# EAGLE design motherboardV2 (EAGLE 7.2.0)
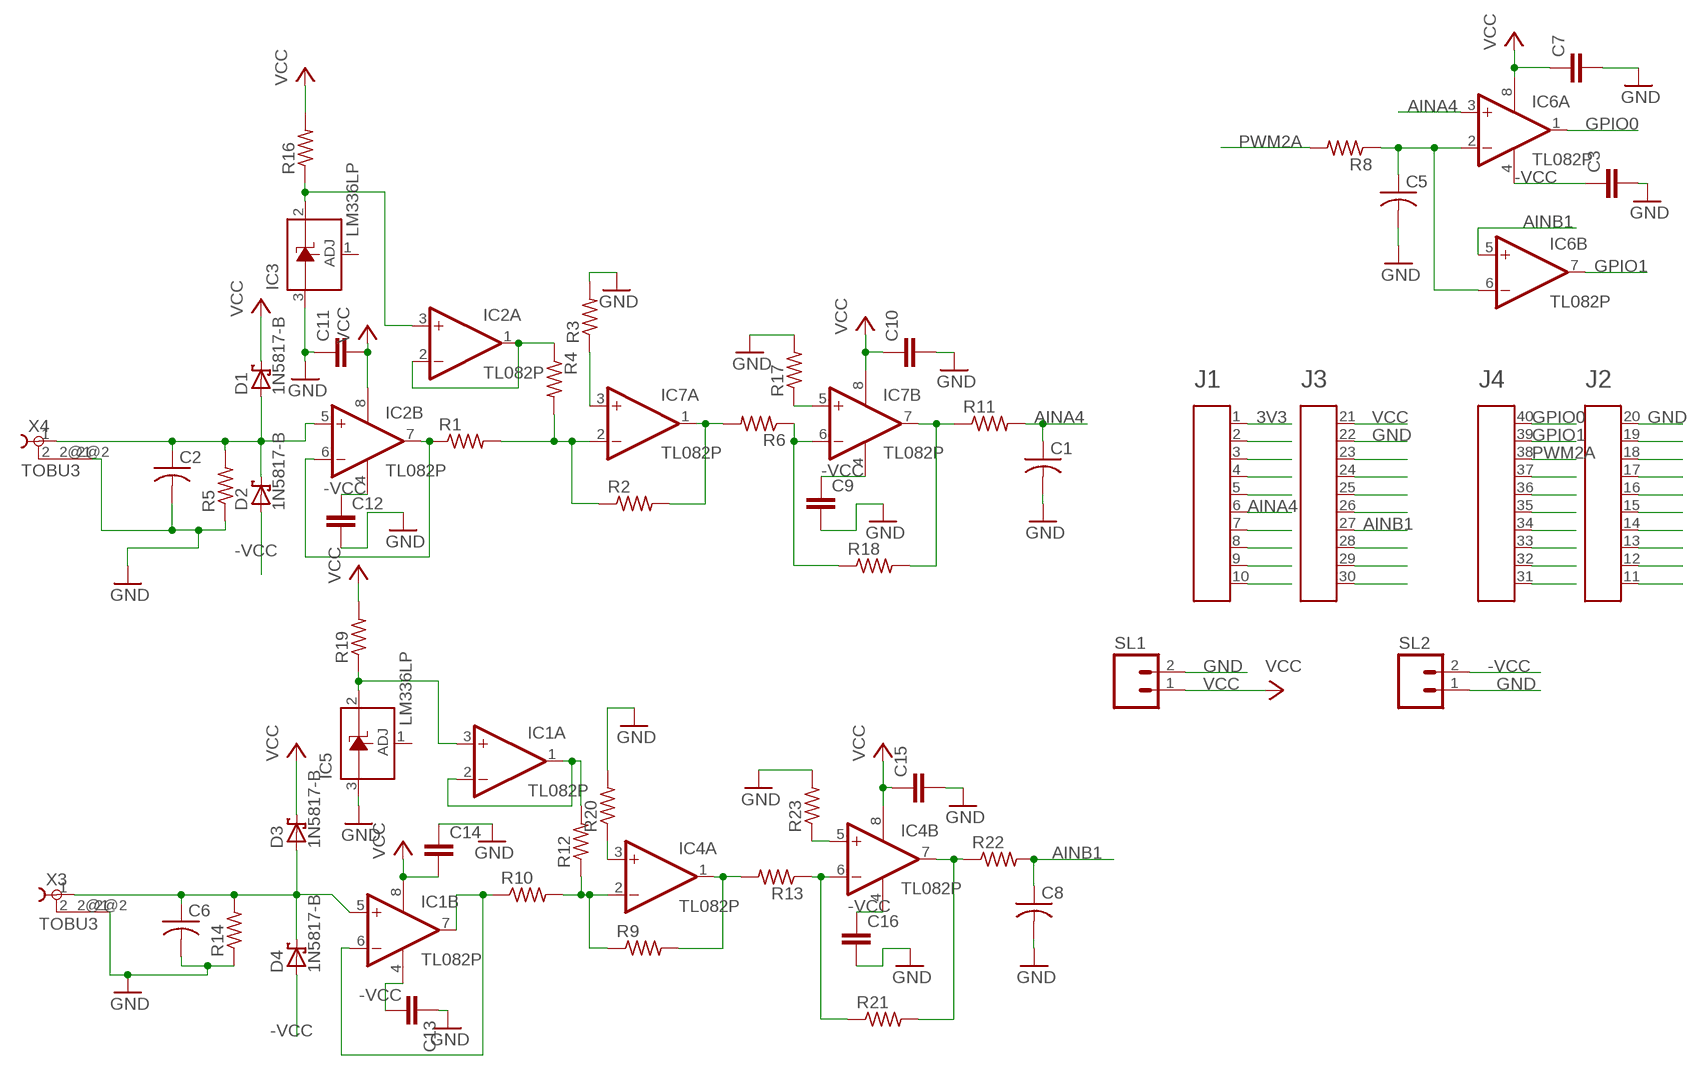
[diagram p0: schematic, sheet 1]

## Parts
A1  HEADER4X10-BOOSTERPACK  [4X10-BOOSTERPACK]
C1  C-US025-025X050  [C025-025X050]
C2  C-US025-025X050  [C025-025X050]
C3  C-EU025-025X050  [C025-025X050]
C5  C-US025-025X050  [C025-025X050]
C6  C-US025-025X050  [C025-025X050]
C7  C-EU025-025X050  [C025-025X050]
C8  C-US025-025X050  [C025-025X050]
C9  C-EU025-025X050  [C025-025X050]
C10  C-EU025-025X050  [C025-025X050]
C11  C-EU025-025X050  [C025-025X050]
C12  C-EU025-030X050  [C025-030X050]
C13  C-EU025-025X050  [C025-025X050]
C14  C-EU025-025X050  [C025-025X050]
C15  C-EU025-025X050  [C025-025X050]
C16  C-EU025-025X050  [C025-025X050]
D1  1N5817-B  [DO41-7.6]
D2  1N5817-B  [DO41-7.6]
D3  1N5817-B  [DO41-7.6]
D4  1N5817-B  [DO41-7.6]
IC1  TL082P  [DIL08]
IC2  TL082P  [DIL08]
IC3  LM336LP  [TO92]
IC4  TL082P  [DIL08]
IC5  LM336LP  [TO92]
IC6  TL082P  [DIL08]
IC7  TL082P  [DIL08]
R1  R-US_0207/7  [0207/7]
R2  R-US_0207/7  [0207/7]
R3  R-US_0207/7  [0207/7]
R4  R-US_0207/7  [0207/7]
R5  R-US_0207/7  [0207/7]
R6  R-US_0207/7  [0207/7]
R8  R-US_0207/7  [0207/7]
R9  R-US_0207/7  [0207/7]
R10  R-US_0207/7  [0207/7]
R11  R-US_0207/7  [0207/7]
R12  R-US_0207/7  [0207/7]
R13  R-US_0207/7  [0207/7]
R14  R-US_0207/7  [0207/7]
R16  R-US_0207/7  [0207/7]
R17  R-US_0207/7  [0207/7]
R18  R-US_0207/7  [0207/7]
R19  R-US_0207/7  [0207/7]
R20  R-US_0207/7  [0207/7]
R21  R-US_0207/7  [0207/7]
R22  R-US_0207/7  [0207/7]
R23  R-US_0207/7  [0207/7]
SL1  M02  [02P]
SL2  M02  [02P]
X3  TOBU3  [TOBU3]
X4  TOBU3  [TOBU3]

## Nets
3V3: A1.1
-VCC: C3.1 C9.1 C12.1 C13.2 C16.1 D2.A D4.A IC1.4(P:V-) IC2.4(P:V-) IC4.4(P:V-) IC6.4(P:V-) IC7.4(P:V-) SL2.2
AINA4: A1.6 C1.1 IC6.3(A:+IN) R11.2
AINB1: A1.27 C8.1 IC6.5(B:+IN) R22.2
GND: A1.20 A1.22 C1.2 C2.2 C3.2 C5.2 C6.2 C7.2 C8.2 C9.2 C10.2 C11.1 C12.2 C13.1 C14.1 C15.2 C16.2 IC3.3(A) IC5.3(A) R3.2 R5.1 R14.1 R17.2 R20.2 R23.2 SL1.2 SL2.1 X3.2@2 X4.2@2
GPIO0: A1.40 IC6.1(A:OUT)
GPIO1: A1.39 IC6.7(B:OUT)
N$1: A1.12
N$2: IC2.3(A:+IN) IC3.2(C) R16.1
N$3: IC7.2(A:-IN) R1.2 R2.1 R4.2
N$4: C6.1 D3.A D4.C IC1.5(B:+IN) R14.2 X3.1
N$5: IC7.1(A:OUT) R2.2 R6.2
N$6: IC7.3(A:+IN) R3.1
N$7: IC1.3(A:+IN) IC5.2(C) R19.1
N$8: C5.1 IC6.2(A:-IN) IC6.6(B:-IN) R8.1
N$9: A1.11
N$11: IC2.1(A:OUT) IC2.2(A:-IN) R4.1
N$13: IC7.6(B:-IN) R6.1 R18.1
N$14: IC4.2(A:-IN) R9.1 R10.2 R12.1
N$16: IC1.1(A:OUT) IC1.2(A:-IN) R12.2
N$17: IC7.5(B:+IN) R17.1
N$19: C2.1 D1.A D2.C IC2.5(B:+IN) R5.2 X4.1
N$20: IC4.1(A:OUT) R9.2 R13.2
N$21: IC7.7(B:OUT) R11.1 R18.2
N$22: IC4.3(A:+IN) R20.1
N$23: IC4.7(B:OUT) R21.2 R22.1
N$24: IC4.6(B:-IN) R13.1 R21.1
N$25: IC4.5(B:+IN) R23.1
N$26: A1.2
N$27: A1.3
N$28: A1.4
N$29: A1.5
N$31: A1.7
N$32: A1.8
N$33: A1.9
N$34: IC1.6(B:-IN) IC1.7(B:OUT) R10.1
N$35: A1.23
N$36: A1.24
N$37: A1.25
N$38: A1.26
N$40: A1.28
N$41: A1.29
N$42: A1.10
N$43: A1.30
N$44: IC2.6(B:-IN) IC2.7(B:OUT) R1.1
N$47: A1.37
N$48: A1.36
N$49: A1.35
N$50: A1.34
N$51: A1.33
N$52: A1.32
N$53: A1.31
N$55: A1.19
N$56: A1.18
N$57: A1.17
N$58: A1.16
N$59: A1.15
N$60: A1.14
N$61: A1.13
PWM2A: A1.38 R8.2
VCC: A1.21 C7.1 C10.1 C11.2 C14.2 C15.1 D1.C D3.C IC1.8(P:V+) IC2.8(P:V+) IC4.8(P:V+) IC6.8(P:V+) IC7.8(P:V+) R16.2 R19.2 SL1.1
Unconnected: IC3.1(ADJ) IC5.1(ADJ) X3.2 X3.2@1 X4.2 X4.2@1

## Library data of the parts
A1 = EAGLE_BoosterPack_Library:HEADER4X10-BOOSTERPACK
C1 C2 C5 C6 C8 = rcl:C-US: CAPACITOR, American symbol
C3 C7 C9-C16 = rcl:C-EU: CAPACITOR, European symbol
D1-D4 = diode:1N581*: 1.0A SCHOTTKY BARRIER RECTIFIER Source: http://www.diodes.com/datasheets/ds23001.pdf
IC1 IC2 IC4 IC6 IC7 = linear:TL082: OP AMP Data sheet <http://www.ti.com/lit/ds/symlink/tl084a . pdf>; DATA_SHEET: <a href="http://www.ti.com/lit/ds/symlink/tl084a.pdf"> Data sheet </a>
IC3 IC5 = linear:LM336: 2.5-V INTEGRATED REFERENCE CIRCUITS LM236 Source: http://focus.ti.com/lit/ds/symlink/lm336-2.5.pdf
R1-R6 R9-R14 R17 R18 = resistor:R-US_: RESISTOR, American symbol
R8 R16 R19-R23 = rcl:R-US_: RESISTOR, American symbol
SL1 SL2 = CEDT_JANUARY_2015_v5:M02: AMP QUICK CONNECTOR
X3 X4 = CEDT_JANUARY_2015_v5:TOBU3: Female Cinch CONNECTOR ( RCA Jack )

## Board
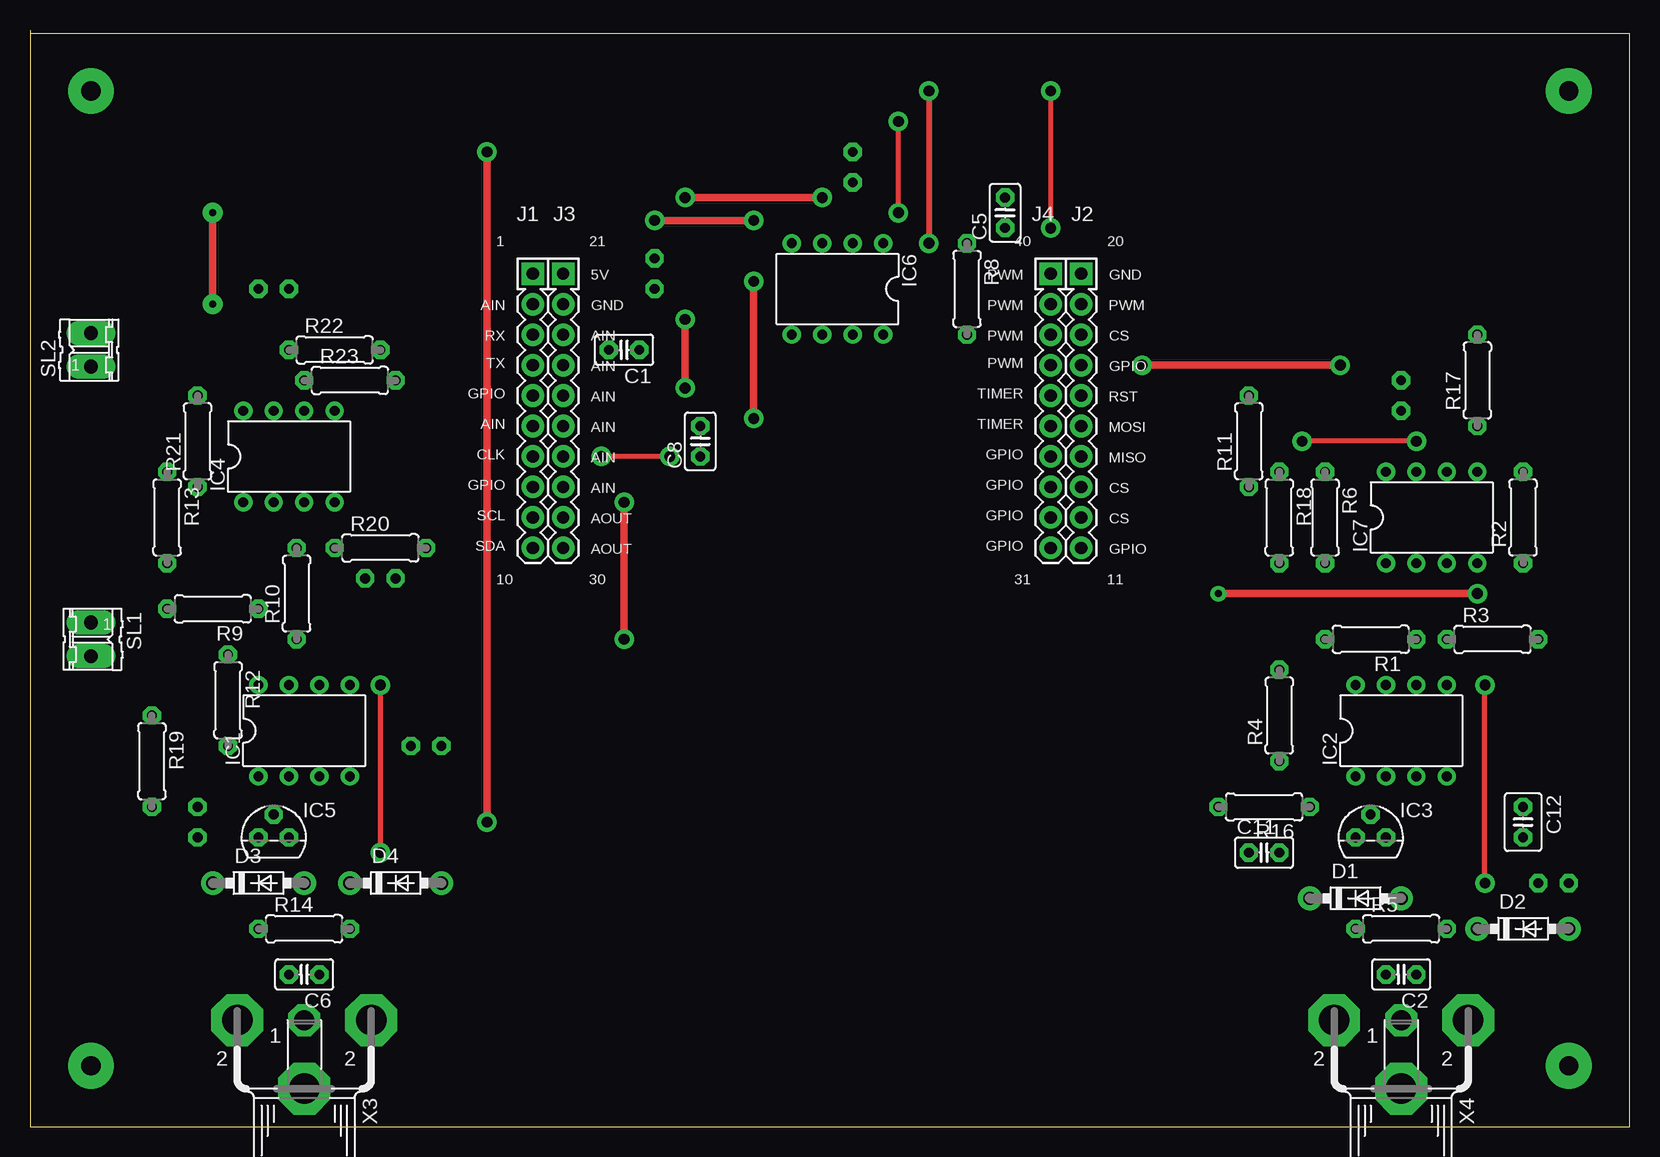
[diagram p1: board, top side]
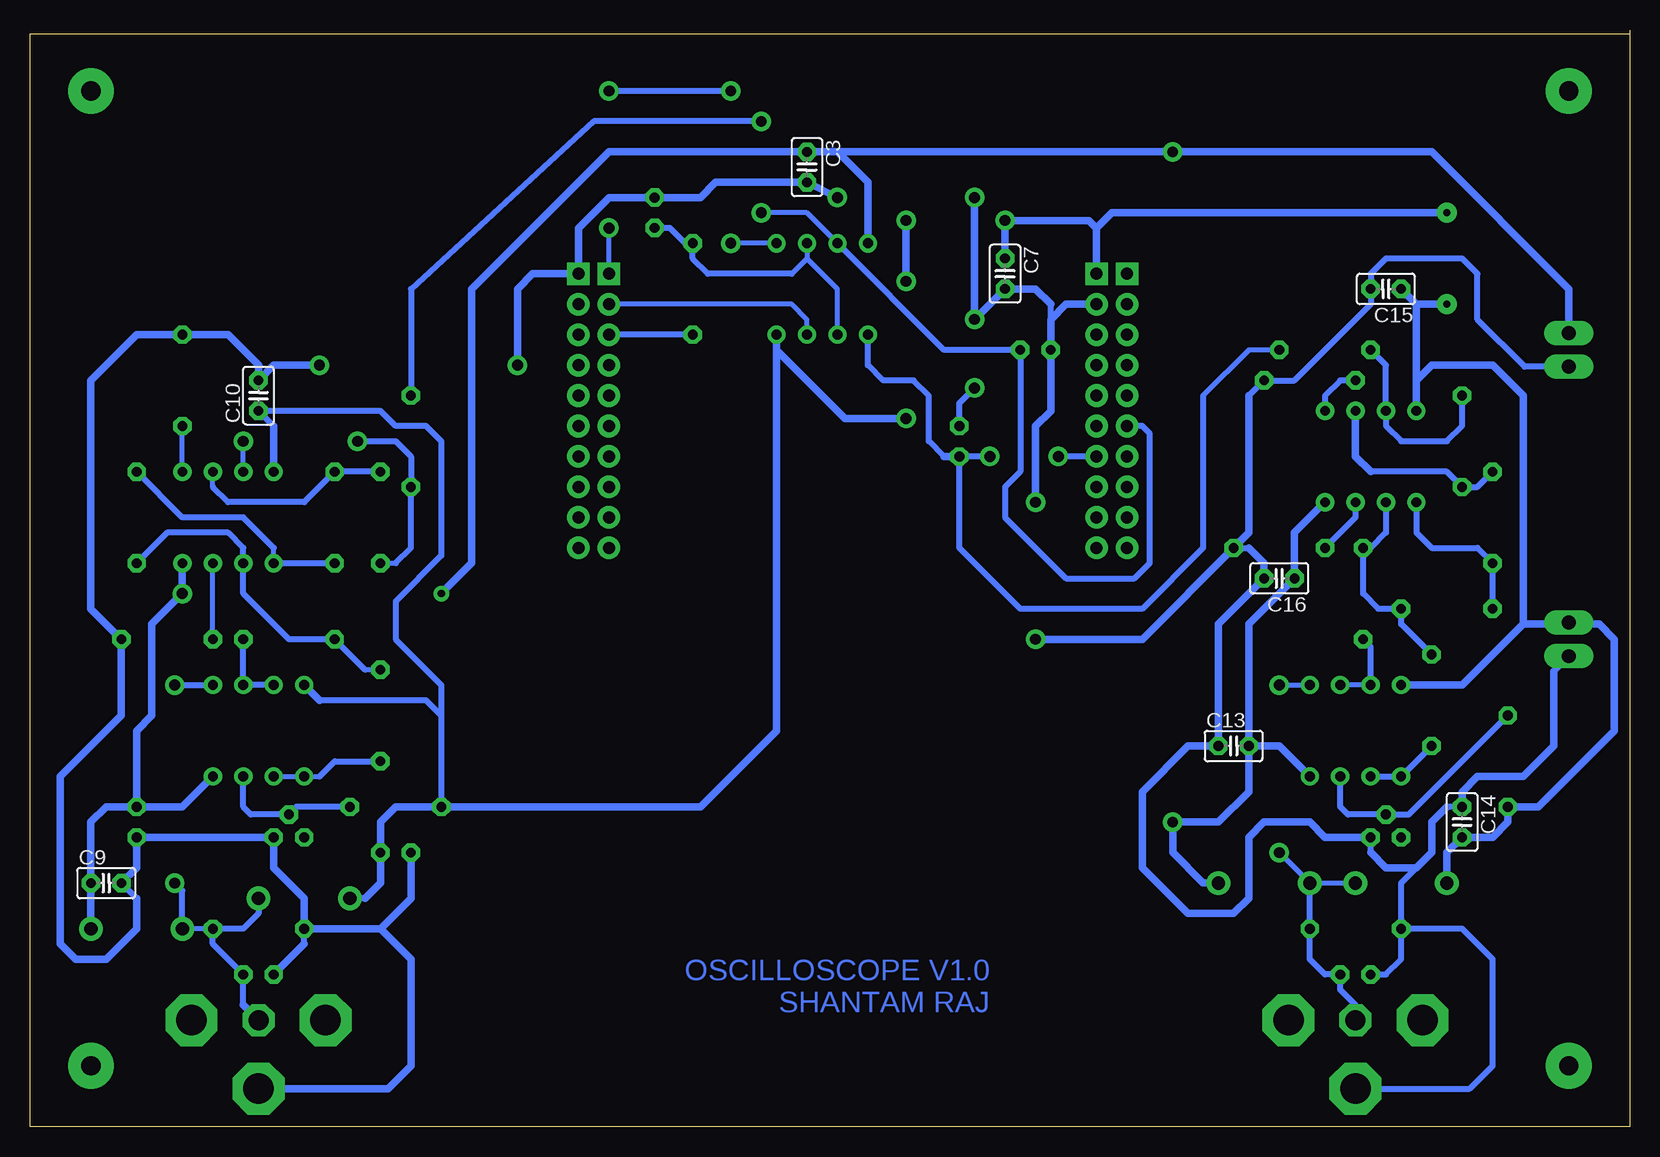
[diagram p2: board, bottom side, seen from below]

Size 133.35 x 91.44 mm. Coordinates in mm from the lower left corner, seen from the top.
Outline: 0.01,91.11 133.35,91.11 133.35,0 0.01,0
Outline: 0,91.44 0,0
Copper layers (1*16): Top 0.035mm / dielectric 1.5mm / Bottom 0.035mm
Design rules "default *": minimum track width 10mil, minimum drill 24mil, track to track 8mil, track to pad 8mil, pad to pad 8mil, via to via 8mil, smd to smd 8mil, copper to edge 40mil, drill to drill 8mil, minimum pad ring 14mil, minimum via ring 14mil, stop-mask expansion 4mil, vias tented up to drill 0mil, thermal gap 10mil

### Footprints (pad centres in the part's own frame; a part is rotated, then mirrored left to right if it is on the bottom)
4X10-BOOSTERPACK = drill 1.016 pad 1.88 square: 1 0,10.16; 20 45.72,10.16; 21 2.54,10.16; 40 43.18,10.16 | drill 1.016 pad 1.88: 2 0,7.62; 3 0,5.08; 4 0,2.54; 5 0,0; 6 0,-2.54; 7 0,-5.08; 8 0,-7.62; 9 0,-10.16; 10 0,-12.7; 11 45.72,-12.7; 12 45.72,-10.16; 13 45.72,-7.62; 14 45.72,-5.08; 15 45.72,-2.54; 16 45.72,0; 17 45.72,2.54; 18 45.72,5.08; 19 45.72,7.62; 22 2.54,7.62; 23 2.54,5.08; 24 2.54,2.54; 25 2.54,0; 26 2.54,-2.54; 27 2.54,-5.08; 28 2.54,-7.62; 29 2.54,-10.16; 30 2.54,-12.7; 31 43.18,-12.7; 32 43.18,-10.16; 33 43.18,-7.62; 34 43.18,-5.08; 35 43.18,-2.54; 36 43.18,0; 37 43.18,2.54; 38 43.18,5.08; 39 43.18,7.62
C025-025X050 = drill 0.813 octagon: 1 -1.27,0; 2 1.27,0
C025-030X050 = drill 0.813 octagon: 1 -1.27,0; 2 1.27,0
DO41-7.6 = drill 1.1 pad 1.7: A 3.81,0; C -3.81,0
DIL08 = drill 0.813 pad 1.27: 1 -3.81,-3.81; 2 -1.27,-3.81; 3 1.27,-3.81; 4 3.81,-3.81; 5 3.81,3.81; 6 1.27,3.81; 7 -1.27,3.81; 8 -3.81,3.81
TO92 = drill 0.813 octagon: 1 -1.27,0; 2 0,1.905; 3 1.27,0
0207/7 = drill 0.813 octagon: 1 -3.81,0; 2 3.81,0
02P = drill 1.143 long: 1 -1.397,0; 2 1.397,0
TOBU3 = drill 1.651 pad 2.54 octagon: 1 0,-2.54 | drill 2.54 pad 4.318 octagon: 2 5.588,-2.54; 2@1 -5.588,-2.54; 2@2 0,3.175

### Placement (x,y rotation side)
A1  41.91,60.96 0 top
C1  49.53,64.77 180 top
C2  114.3,12.7 180 top
C3  68.58,80.01 270 bottom
C5  81.28,76.2 90 top
C6  22.86,12.7 180 top
C7  52.07,71.12 270 bottom
C8  55.88,57.15 90 top
C9  127,20.32 0 bottom
C10  114.3,60.96 90 bottom
C11  102.87,22.86 0 top
C12  124.46,25.4 270 top
C13  33.02,31.75 0 bottom
C14  13.97,25.4 270 bottom
C15  20.32,69.85 180 bottom
C16  29.21,45.72 180 bottom
D1  110.49,19.05 0 top
D2  124.46,16.51 0 top
D3  19.05,20.32 0 top
D4  30.48,20.32 0 top
IC1  22.86,33.02 0 top
IC2  114.3,33.02 0 top
IC3  111.76,24.13 0 top
IC4  21.59,55.88 0 top
IC5  20.32,24.13 0 top
IC6  67.31,69.85 180 top
IC7  116.84,50.8 0 top
R1  111.76,40.64 180 top
R2  124.46,50.8 90 top
R3  121.92,40.64 0 top
R4  104.14,34.29 90 top
R5  114.3,16.51 0 top
R6  107.95,50.8 270 top
R8  78.11,69.85 270 top
R9  15.24,43.18 180 top
R10  22.23,44.45 90 top
R11  101.6,57.15 90 top
R12  16.51,35.56 270 top
R13  11.43,50.8 270 top
R14  22.86,16.51 0 top
R16  102.87,26.67 180 top
R17  120.65,62.23 90 top
R18  104.14,50.8 270 top
R19  10.16,30.48 270 top
R20  29.21,48.26 0 top
R21  13.97,57.15 90 top
R22  25.4,64.77 0 top
R23  26.67,62.23 0 top
SL1  5.08,40.64 270 top
SL2  5.08,64.77 90 top
X3  22.86,6.35 180 top
X4  114.3,6.35 180 top

### Tracks (layer width: path | path; a pad name or v marks a point on that pad's centre or on a via)
-VCC  (via drill 0.6, 0.9 pad 0.41)
  Top 0.61: v38.1,25.4 v38.1,81.28 | v99.06,44.45 v120.65,44.45
  Bottom 0.61: C13.2 29.21,31.75 IC1.4 | D2.A C9.1 128.27,25.4 127,26.67 C12.1 | C13.2 31.75,41.91 C16.1 27.94,49.53 IC4.4 | 66.04,81.28 v38.1,81.28 16.51,81.28 5.08,69.85 SL2.2 | 66.04,81.28 C3.1 85.09,81.28 96.52,69.85 96.52,46.99 v99.06,44.45 | IC6.4 63.5,78.74 66.04,81.28 | IC7.4 v120.65,44.45 123.19,41.91 123.19,34.29 124.46,33.02 C12.1 | IC2.4 120.65,26.67 C12.1 | D4.A 35.56,20.32 38.1,22.86 v38.1,25.4 34.29,25.4 31.75,27.94 C13.2
AINA4  (via drill 0.6, 0.9 pad 0.41)
  Top 0.406: v72.39,76.2 v72.39,83.82
  Bottom 0.406: IC6.3 68.58,76.2 v72.39,76.2
  Bottom 0.508: v72.39,83.82 86.36,83.82 101.6,69.85 R11.2 | A1.6 40.64,58.42 40.01,57.78 40.01,46.99 41.27,45.72 46.99,45.72 52.07,50.8 52.07,53.34 50.8,54.61 C1.1 57.15,64.77 IC6.3
AINB1  (via drill 0.6, 0.9 pad 0.41)
  Top 0.406: v53.34,55.88 v47.62,55.88
  Bottom 0.406: IC6.5 63.5,64.77 | R22.2 31.75,64.77 35.56,60.96
  Bottom 0.508: 35.56,60.96 35.56,48.26 40.64,43.18 50.8,43.18 55.88,48.26 C8.1 v53.34,55.88 | 57.15,55.88 58.42,57.15 58.42,60.96 59.69,62.23 62.23,62.23 63.5,63.5 IC6.5 | A1.27 v47.62,55.88
  Bottom 0.61: C8.1 57.15,55.88
GND  (via drill 0.6, 0.9 pad 0.41)
  Top 0.61: v92.71,63.5 v109.22,63.5 | v54.61,61.59 v54.61,67.31 | v54.61,77.47 v66.04,77.47 | v49.53,52.07 v49.53,40.64
  Bottom 0.406: A1.22 45.72,68.58
  Bottom 0.508: 31.75,60.96 R23.2 27.94,62.23 21.59,68.58 C15.2 21.59,71.12 20.32,72.39 13.97,72.39 12.7,71.12 12.7,67.31 8.76,63.37 SL2.1 | 110.49,15.24 R5.1 | 124.46,19.05 C9.2 | 48.26,67.31 48.26,68.58 | C8.2 55.88,60.33 v54.61,61.59 | C14.1 15.24,26.67 | 21.59,22.86 IC5.3 | R14.1 19.05,20.32 17.78,21.59 | X3.2@2 13.34,3.17 11.43,5.08 11.43,13.97 13.97,16.51 R14.1 | C6.2 20.32,12.7 19.05,13.97 R14.1 | 6.35,37.97 SL1.2 | R20.2 31.75,48.26
  Bottom 0.61: C2.2 110.49,15.24 | 124.46,19.05 124.46,16.51 127,13.97 129.54,13.97 130.81,15.24 130.81,29.21 125.73,34.29 R3.2 128.27,43.18 128.27,62.23 124.46,66.04 R17.2 116.84,66.04 114.3,63.5 C10.2 113.03,63.5 v109.22,63.5 | v92.71,63.5 92.71,69.85 91.44,71.12 A1.20 87.63,74.93 85.09,77.47 C5.2 77.47,77.47 76.2,78.74 C3.2 v66.04,77.47 | v54.61,77.47 v54.61,67.31 C7.2 49.53,69.85 48.26,68.58 | v49.53,52.07 49.53,58.42 48.26,59.69 C1.2 48.26,67.31 46.99,68.58 A1.22 | v49.53,40.64 40.64,40.64 R20.2 31.75,49.53 31.75,60.96 | 15.24,26.67 16.51,25.4 16.51,22.86 17.78,21.59 20.32,21.59 21.59,22.86 | IC5.3 25.4,24.13 26.67,25.4 30.48,25.4 31.75,24.13 31.75,19.05 33.02,17.78 36.83,17.78 40.64,21.59 40.64,27.94 36.83,31.75 C13.1 34.29,41.91 C16.2 30.48,46.99 31.75,48.26 | C14.1 13.97,27.94 12.7,29.21 8.89,29.21 6.35,31.75 6.35,37.97 | X4.2@2 103.5,3.17 101.6,5.08 101.6,13.97 104.14,16.51 | 104.14,16.51 R5.1 110.49,19.05 113.03,21.59 IC3.3 C12.2 124.46,21.59 C9.2 | 104.14,16.51 101.6,19.05 C11.1
GPIO0  (via drill 0.6, 0.9 pad 0.41)
  Top 0.406: v85.09,74.93 v85.09,86.36
  Top 0.508: v74.93,86.36 v74.93,73.66
  Bottom 0.406: IC6.1 v74.93,73.66 | A1.40 v85.09,74.93
  Bottom 0.508: v85.09,86.36 v74.93,86.36
GPIO1
  Bottom 0.406: IC6.7 68.58,67.31 69.85,68.58 A1.39
N$2
  Bottom 0.508: IC2.3 115.57,26.67 114.94,26.04 IC3.2 111.12,26.67 R16.1
N$3
  Bottom 0.406: R4.2 105.41,38.1
  Bottom 0.508: 105.41,38.1 R1.2 111.76,40.64 115.57,44.45 IC7.2 115.57,48.26 116.84,49.53 121.92,49.53 R2.1
N$4  (via drill 0.6, 0.9 pad 0.41)
  Top 0.406: v29.21,22.86 v29.21,36.83
  Bottom 0.406: D3.A D4.C v29.21,22.86 | v29.21,36.83 IC1.5
  Bottom 0.508: D4.C R14.2 26.67,13.97 25.4,12.7 C6.1 24.13,11.43 22.86,10.16 X3.1
N$5
  Bottom 0.406: IC7.1 113.03,48.26
  Bottom 0.508: IC7.1 R6.2 | 113.03,48.26 115.57,50.8 120.65,50.8 R2.2
N$6
  Bottom 0.406: R3.1 IC7.3
N$7
  Bottom 0.508: R19.1 18.41,26.04 IC5.2 23.5,26.04 24.13,26.67 IC1.3
N$8
  Bottom 0.406: IC6.2 68.58,72.39 | 68.58,72.39 69.85,71.12 | IC6.6 66.04,69.85 68.58,72.39
  Bottom 0.508: 69.85,71.12 76.83,71.12 78.11,72.39 R8.1 78.74,73.66 80.01,74.93 C5.1
N$11
  Bottom 0.406: IC2.2 IC2.1 109.22,29.21
  Bottom 0.508: 109.22,29.21 107.95,30.48 R4.1
N$12  (via drill 1.6 pad 3.81)
  other vias: 5.08,5.08
N$13
  Bottom 0.406: 118.11,53.34 IC7.6
  Bottom 0.508: 118.11,53.34 116.84,52.07 110.49,52.07 R6.1 R18.1
N$14
  Bottom 0.508: R12.1 19.05,41.91 R9.1 20.95,43.18 22.23,44.45 R10.2 21.59,48.26 20.32,49.53 IC4.2
N$15  (via drill 1.6 pad 3.81)
  other vias: 5.08,86.36
N$16
  Bottom 0.508: IC1.2 IC1.1 R12.2
N$17
  Bottom 0.406: IC7.5 R17.1
N$18  (via drill 1.6 pad 3.81)
  other vias: 128.27,86.36
N$19  (via drill 0.6, 0.9 pad 0.41)
  Top 0.406: v121.28,20.32 v121.28,36.83
  Bottom 0.406: R5.2 D2.C
  Bottom 0.508: 115.57,10.16 C2.1 118.11,15.24 R5.2 115.57,16.51 114.3,17.78 D1.A | v121.28,36.83 IC2.5 | D2.C 120.65,19.68 v121.28,20.32
  Bottom 0.61: X4.1 115.57,10.16
N$20
  Bottom 0.508: IC4.1 17.78,49.53 16.51,48.26 12.7,48.26 R13.2 R9.2
N$21  (via drill 0.6, 0.9 pad 0.41)
  Top 0.406: v115.57,57.15 v106.05,57.15
  Bottom 0.406: R18.2 102.87,46.99 | IC7.7 v115.57,57.15
  Bottom 0.508: 102.87,46.99 101.6,48.26 R11.1 101.6,55.88 102.87,57.15 v106.05,57.15
N$22
  Bottom 0.508: IC4.3 22.86,50.8 R20.1
N$23
  Bottom 0.508: R22.1 20.32,63.5 IC4.7 20.32,58.42 19.05,57.15 15.24,57.15 13.97,58.42 R21.2
N$24
  Bottom 0.508: 21.59,54.61 15.24,54.61 R21.1 12.7,53.34 R13.1
  Bottom 0.61: 21.59,54.61 22.86,55.88 IC4.6
N$25
  Bottom 0.508: R23.1 24.13,62.23 25.4,60.96 IC4.5
N$30  (via drill 1.6 pad 3.81)
  other vias: 128.27,5.08
N$34
  Bottom 0.406: IC1.7 IC1.6
  Bottom 0.508: IC1.7 21.59,40.01 R10.1
N$44
  Bottom 0.508: IC2.7 IC2.6 R1.1
PWM2A
  Bottom 0.508: R8.2 A1.38
VCC  (via drill 0.6 pad 1.68, 0.9 pad 0.41)
  Top 0.61: v52.07,75.56 v60.33,75.56 | v60.33,70.48 v60.33,59.05 | v15.24,76.2 v15.24,68.58
  Bottom 0.508: 17.78,62.23 IC4.8 | 109.22,35.56 100.33,35.56 99.06,34.29 | 4.95,41.91 SL1.1 5.21,41.91 | 105.41,19.05 D1.C | 97.79,26.67 R16.2 99.06,34.29 | 99.06,34.29 99.06,36.83 102.87,40.64 102.87,43.81 99.06,47.62 99.06,57.15 100.33,58.42 102.87,58.42 104.14,59.69 C10.1 113.03,58.42
  Bottom 0.61: D3.C 15.24,22.86 C14.2 11.43,24.13 10.16,25.4 R19.2 7.62,26.67 1.27,33.02 1.27,40.64 2.54,41.91 4.95,41.91 | IC1.8 13.97,36.83 8.89,41.91 | 17.78,62.23 16.51,63.5 11.43,63.5 8.89,60.96 8.89,41.91 | IC4.8 17.78,68.58 | 109.22,35.56 IC2.8 | IC6.8 71.12,64.77 | IC7.8 113.03,58.42 | 44.45,74.93 43.18,76.2 v15.24,76.2 | C7.1 v52.07,75.56 45.09,75.56 44.45,74.93 | v60.33,75.56 v60.33,70.48 | v60.33,59.05 65.41,59.05 71.12,64.77 | 44.45,74.93 A1.21 | 8.89,41.91 5.21,41.91 | v15.24,68.58 17.78,68.58 | 17.78,68.58 C15.1 | 105.41,19.05 104.14,20.32 C11.2 104.14,25.4 102.87,26.67 R16.2 77.47,26.67 71.12,33.02 71.12,64.77

### Text on the board
Bottom: OSCILLOSCOPE V1.0 / SHANTAM RAJ